# Altium project operacake.PrjPcb
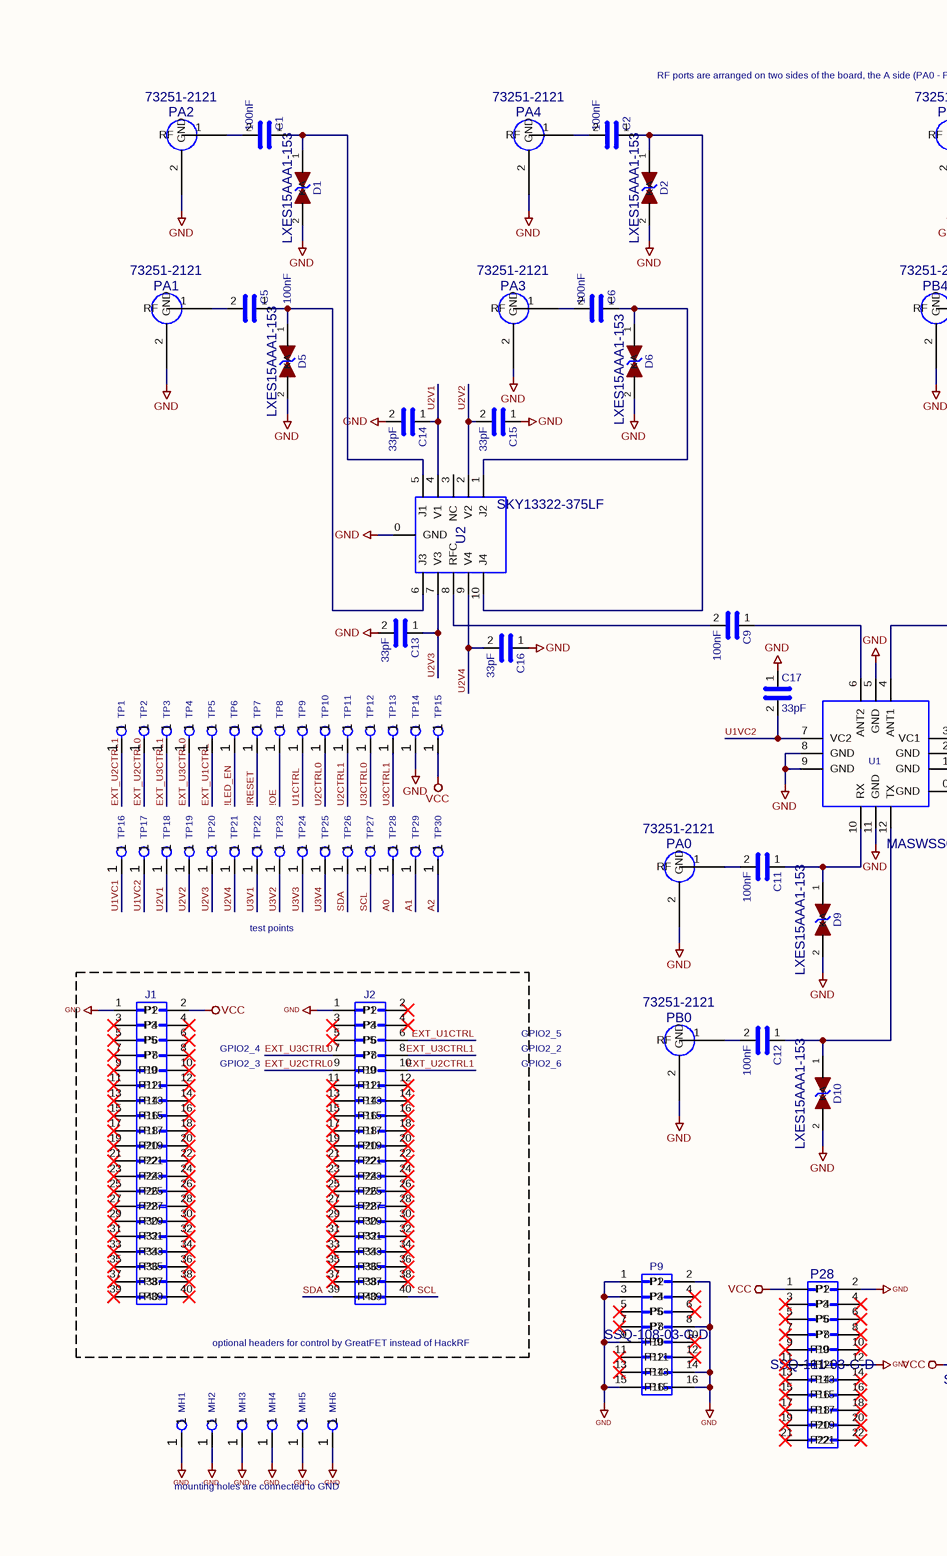
[diagram p0: operacake.SchDoc, left]
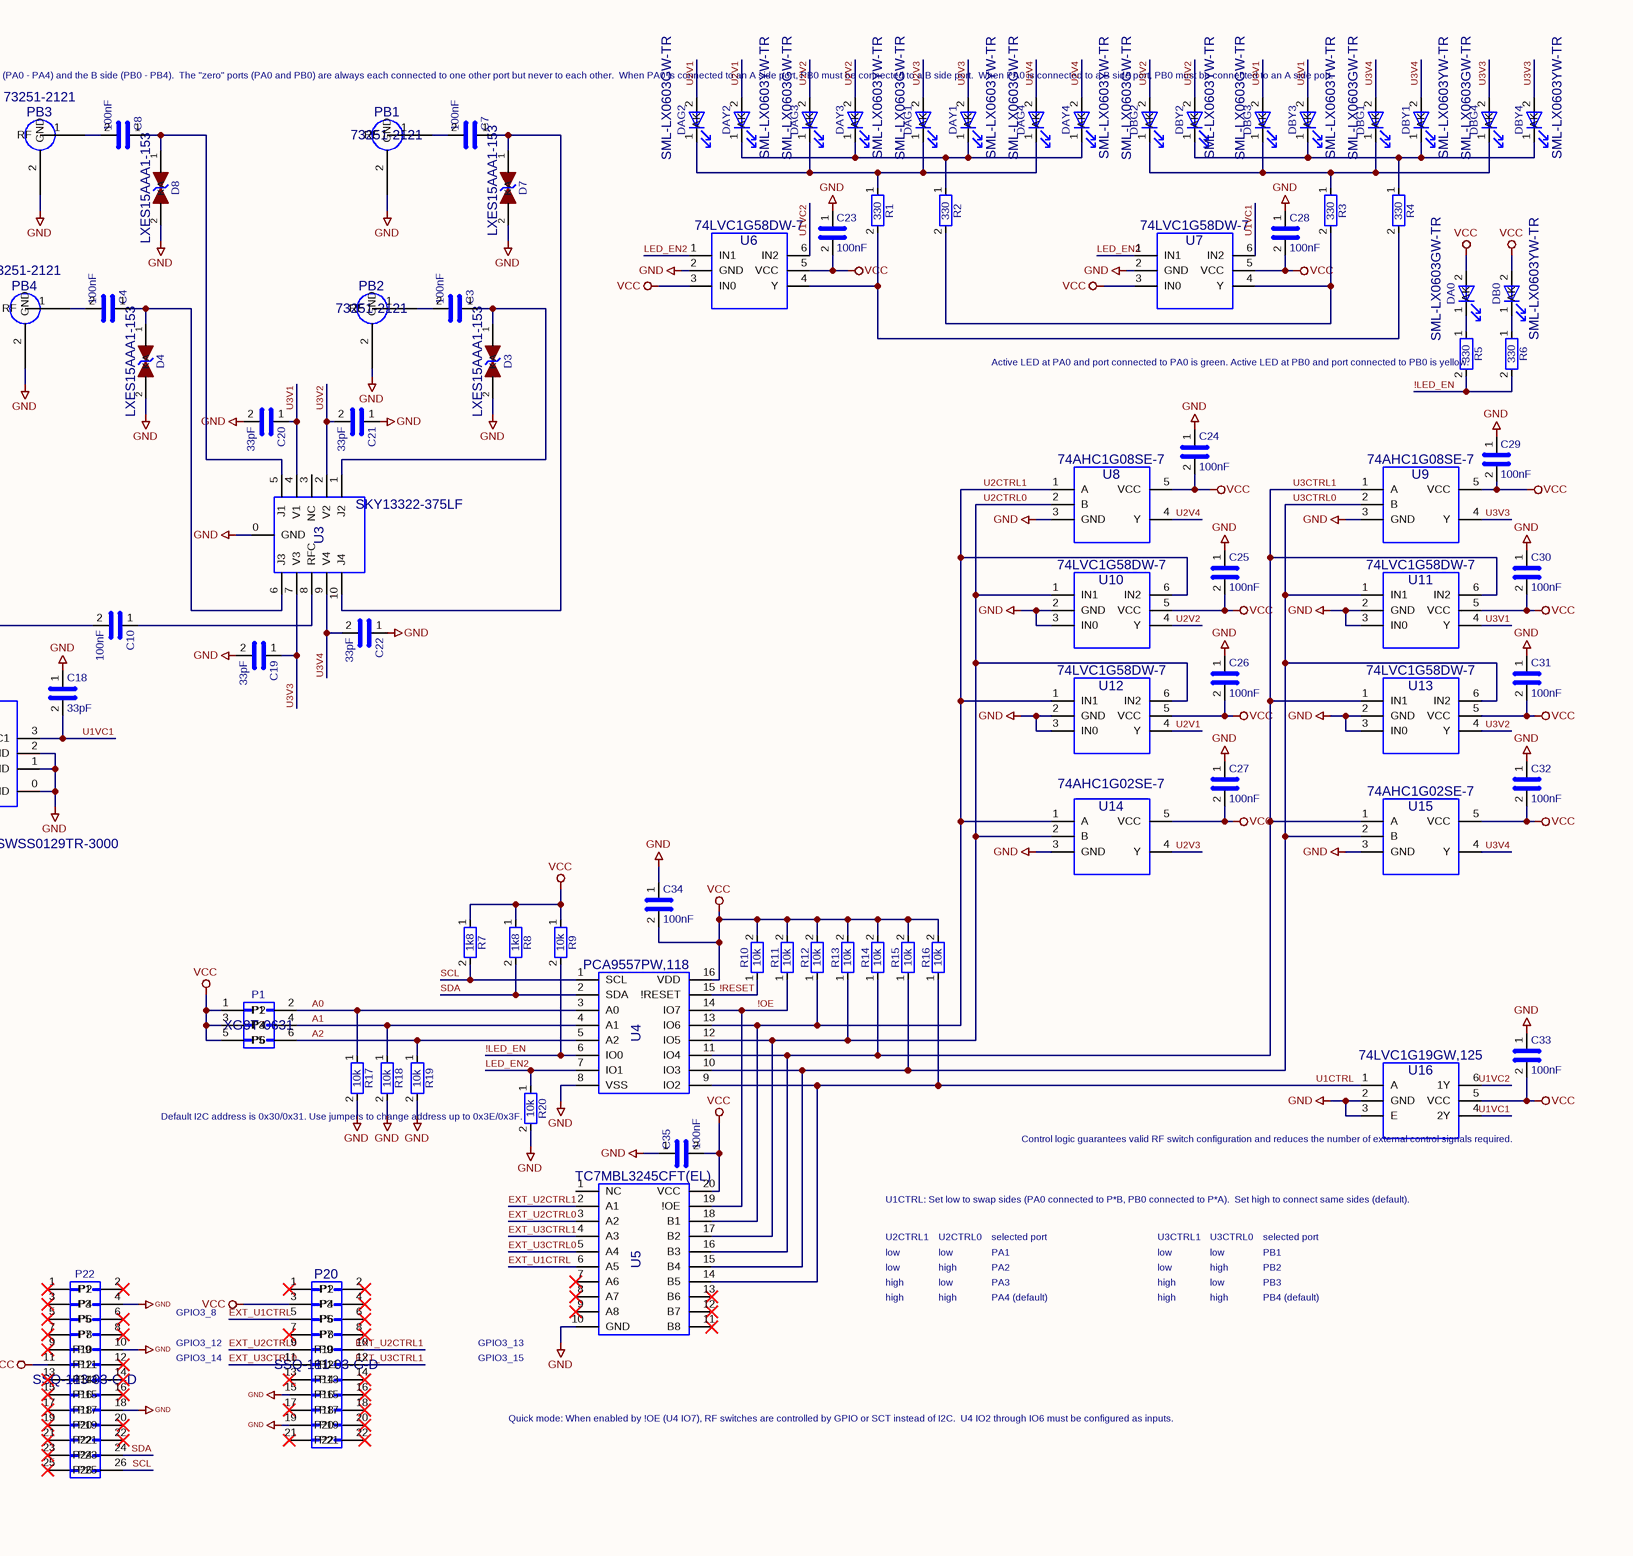
[diagram p1: operacake.SchDoc, right]
1 sheet, 152 parts. Net scope: global (net labels, ports and power ports of the same name join across sheets).
Board file: operacake.PcbDoc

## Sheet operacake.SchDoc
size 431 x 279 mm

### Parts
C1  100nF  [0402]
C2  100nF  [0402]
C3  100nF  [0402]
C4  100nF  [0402]
C5  100nF  [0402]
C6  100nF  [0402]
C7  100nF  [0402]
C8  100nF  [0402]
C9  100nF  [0402]
C10  100nF  [0402]
C11  100nF  [0402]
C12  100nF  [0402]
C13  33pF  [0402]
C14  33pF  [0402]
C15  33pF  [0402]
C16  33pF  [0402]
C17  33pF  [0402]
C18  33pF  [0402]
C19  33pF  [0402]
C20  33pF  [0402]
C21  33pF  [0402]
C22  33pF  [0402]
C23  100nF  [0402]
C24  100nF  [0402]
C25  100nF  [0402]
C26  100nF  [0402]
C27  100nF  [0402]
C28  100nF  [0402]
C29  100nF  [0402]
C30  100nF  [0402]
C31  100nF  [0402]
C32  100nF  [0402]
C33  100nF  [0402]
C34  100nF  [0402]
C35  100nF  [0402]
D1  Part Number: LXES15AAA1-153  [0402]  (hidden comment: GSG-DIODE-TVS-BI)
D2  Part Number: LXES15AAA1-153  [0402]  (hidden comment: GSG-DIODE-TVS-BI)
D3  Part Number: LXES15AAA1-153  [0402]  (hidden comment: GSG-DIODE-TVS-BI)
D4  Part Number: LXES15AAA1-153  [0402]  (hidden comment: GSG-DIODE-TVS-BI)
D5  Part Number: LXES15AAA1-153  [0402]  (hidden comment: GSG-DIODE-TVS-BI)
D6  Part Number: LXES15AAA1-153  [0402]  (hidden comment: GSG-DIODE-TVS-BI)
D7  Part Number: LXES15AAA1-153  [0402]  (hidden comment: GSG-DIODE-TVS-BI)
D8  Part Number: LXES15AAA1-153  [0402]  (hidden comment: GSG-DIODE-TVS-BI)
D9  Part Number: LXES15AAA1-153  [0402]  (hidden comment: GSG-DIODE-TVS-BI)
D10  Part Number: LXES15AAA1-153  [0402]  (hidden comment: GSG-DIODE-TVS-BI)
DA0  Part Number: SML-LX0603GW-TR  [0603D]  (hidden comment: LED)
DAG1  Part Number: SML-LX0603GW-TR  [0603D]  (hidden comment: LED)
DAG2  Part Number: SML-LX0603GW-TR  [0603D]  (hidden comment: LED)
DAG3  Part Number: SML-LX0603GW-TR  [0603D]  (hidden comment: LED)
DAG4  Part Number: SML-LX0603GW-TR  [0603D]  (hidden comment: LED)
DAY1  Part Number: SML-LX0603YW-TR  [0603D]  (hidden comment: LED)
DAY2  Part Number: SML-LX0603YW-TR  [0603D]  (hidden comment: LED)
DAY3  Part Number: SML-LX0603YW-TR  [0603D]  (hidden comment: LED)
DAY4  Part Number: SML-LX0603YW-TR  [0603D]  (hidden comment: LED)
DB0  Part Number: SML-LX0603YW-TR  [0603D]  (hidden comment: LED)
DBG1  Part Number: SML-LX0603GW-TR  [0603D]  (hidden comment: LED)
DBG2  Part Number: SML-LX0603GW-TR  [0603D]  (hidden comment: LED)
DBG3  Part Number: SML-LX0603GW-TR  [0603D]  (hidden comment: LED)
DBG4  Part Number: SML-LX0603GW-TR  [0603D]  (hidden comment: LED)
DBY1  Part Number: SML-LX0603YW-TR  [0603D]  (hidden comment: LED)
DBY2  Part Number: SML-LX0603YW-TR  [0603D]  (hidden comment: LED)
DBY3  Part Number: SML-LX0603YW-TR  [0603D]  (hidden comment: LED)
DBY4  Part Number: SML-LX0603YW-TR  [0603D]  (hidden comment: LED)
J1  CONN_02X20  [HEADER-2x20-REVERSE]  (value not drawn)
J2  CONN_02X20  [HEADER-2x20-REVERSE]  (value not drawn)
MH1  MOUNTING_HOLE  [HOLE126MIL-COPPER]  (value not drawn)
MH2  MOUNTING_HOLE  [HOLE126MIL-COPPER]  (value not drawn)
MH3  MOUNTING_HOLE  [HOLE126MIL-COPPER]  (value not drawn)
MH4  MOUNTING_HOLE  [HOLE126MIL-COPPER]  (value not drawn)
MH5  MOUNTING_HOLE  [HOLE126MIL-COPPER]  (value not drawn)
MH6  MOUNTING_HOLE  [HOLE126MIL-COPPER]  (value not drawn)
P1  Part Number: XG8T-0631  [HEADER-2x3]  (hidden comment: ADDRESS)
P9  Part Number: SSQ-108-03-G-D  [HEADER-2x8]  (hidden comment: BASEBAND)
P20  Part Number: SSQ-111-03-G-D  [HEADER-2x11]  (hidden comment: GPIO)
P22  Part Number: SSQ-113-03-G-D  [HEADER-2x13]  (hidden comment: I2S)
P28  Part Number: SSQ-111-03-G-D  [HEADER-2x11]  (hidden comment: SD)
PA0  Part Number: 73251-2121  [GSG-SMA-73251-2120]  (hidden comment: GSG-RF-CONN)
PA1  Part Number: 73251-2121  [GSG-SMA-73251-2120]  (hidden comment: GSG-RF-CONN)
PA2  Part Number: 73251-2121  [GSG-SMA-73251-2120]  (hidden comment: GSG-RF-CONN)
PA3  Part Number: 73251-2121  [GSG-SMA-73251-2120]  (hidden comment: GSG-RF-CONN)
PA4  Part Number: 73251-2121  [GSG-SMA-73251-2120]  (hidden comment: GSG-RF-CONN)
PB0  Part Number: 73251-2121  [GSG-SMA-73251-2120]  (hidden comment: GSG-RF-CONN)
PB1  Part Number: 73251-2121  [GSG-SMA-73251-2120]  (hidden comment: GSG-RF-CONN)
PB2  Part Number: 73251-2121  [GSG-SMA-73251-2120]  (hidden comment: GSG-RF-CONN)
PB3  Part Number: 73251-2121  [GSG-SMA-73251-2120]  (hidden comment: GSG-RF-CONN)
PB4  Part Number: 73251-2121  [GSG-SMA-73251-2120]  (hidden comment: GSG-RF-CONN)
R1  330  [0603]
R2  330  [0603]
R3  330  [0603]
R4  330  [0603]
R5  330  [0603]
R6  330  [0603]
R7  1k8  [0603]
R8  1k8  [0603]
R9  10k  [0603]
R10  10k  [0603]
R11  10k  [0603]
R12  10k  [0603]
R13  10k  [0603]
R14  10k  [0603]
R15  10k  [0603]
R16  10k  [0603]
R17  10k  [0603]
R18  10k  [0603]
R19  10k  [0603]
R20  10k  [0603]
TP1  CONN_1  [TESTPOINT-50MIL]  (value not drawn)
TP2  CONN_1  [TESTPOINT-50MIL]  (value not drawn)
TP3  CONN_1  [TESTPOINT-50MIL]  (value not drawn)
TP4  CONN_1  [TESTPOINT-50MIL]  (value not drawn)
TP5  CONN_1  [TESTPOINT-50MIL]  (value not drawn)
TP6  CONN_1  [TESTPOINT-50MIL]  (value not drawn)
TP7  CONN_1  [TESTPOINT-50MIL]  (value not drawn)
TP8  CONN_1  [TESTPOINT-50MIL]  (value not drawn)
TP9  CONN_1  [TESTPOINT-50MIL]  (value not drawn)
TP10  CONN_1  [TESTPOINT-50MIL]  (value not drawn)
TP11  CONN_1  [TESTPOINT-50MIL]  (value not drawn)
TP12  CONN_1  [TESTPOINT-50MIL]  (value not drawn)
TP13  CONN_1  [TESTPOINT-50MIL]  (value not drawn)
TP14  CONN_1  [TESTPOINT-50MIL]  (value not drawn)
TP15  CONN_1  [TESTPOINT-50MIL]  (value not drawn)
TP16  CONN_1  [TESTPOINT-50MIL]  (value not drawn)
TP17  CONN_1  [TESTPOINT-50MIL]  (value not drawn)
TP18  CONN_1  [TESTPOINT-50MIL]  (value not drawn)
TP19  CONN_1  [TESTPOINT-50MIL]  (value not drawn)
TP20  CONN_1  [TESTPOINT-50MIL]  (value not drawn)
TP21  CONN_1  [TESTPOINT-50MIL]  (value not drawn)
TP22  CONN_1  [TESTPOINT-50MIL]  (value not drawn)
TP23  CONN_1  [TESTPOINT-50MIL]  (value not drawn)
TP24  CONN_1  [TESTPOINT-50MIL]  (value not drawn)
TP25  CONN_1  [TESTPOINT-50MIL]  (value not drawn)
TP26  CONN_1  [TESTPOINT-50MIL]  (value not drawn)
TP27  CONN_1  [TESTPOINT-50MIL]  (value not drawn)
TP28  CONN_1  [TESTPOINT-50MIL]  (value not drawn)
TP29  CONN_1  [TESTPOINT-50MIL]  (value not drawn)
TP30  CONN_1  [TESTPOINT-50MIL]  (value not drawn)
U1  Part Number: MASWSS0129TR-3000  [QFN12-3]  (hidden comment: MASWSS0129)
U2  SKY13322  [SKY13322-375LF]  (value not drawn)
U3  SKY13322  [SKY13322-375LF]  (value not drawn)
U4  Part Number: PCA9557PW,118  [TSSOP16]  (hidden comment: PCA9557)
U5  Part Number: TC7MBL3245CFT(EL)  [TSSOP20]  (hidden comment: TC7MBL3245CFT)
U6  Part Number: 74LVC1G58DW-7  [SOT363]  (hidden comment: 74LVC1G58)
U7  Part Number: 74LVC1G58DW-7  [SOT363]  (hidden comment: 74LVC1G58)
U8  Part Number: 74AHC1G08SE-7  [SOT353-1]  (hidden comment: 74AHC1G08)
U9  Part Number: 74AHC1G08SE-7  [SOT353-1]  (hidden comment: 74AHC1G08)
U10  Part Number: 74LVC1G58DW-7  [SOT363]  (hidden comment: 74LVC1G58)
U11  Part Number: 74LVC1G58DW-7  [SOT363]  (hidden comment: 74LVC1G58)
U12  Part Number: 74LVC1G58DW-7  [SOT363]  (hidden comment: 74LVC1G58)
U13  Part Number: 74LVC1G58DW-7  [SOT363]  (hidden comment: 74LVC1G58)
U14  Part Number: 74AHC1G02SE-7  [SOT353-1]  (hidden comment: 74AHC1G02)
U15  Part Number: 74AHC1G02SE-7  [SOT353-1]  (hidden comment: 74AHC1G02)
U16  Part Number: 74LVC1G19GW,125  [SOT363]  (hidden comment: 74LVC1G19)

### Nets
GND: C13.2 C14.2 C15.1 C16.1 C17.1 C18.1 C19.2 C20.2 C21.1 C22.1 C23.1 C24.1 C25.1 C26.1 C27.1 C28.1 C29.1 C30.1 C31.1 C32.1 C33.1 C34.1 C35.1 D1.2(K) D2.2(K) D3.2(K) D4.2(K) D5.2(K) D6.2(K) D7.2(K) D8.2(K) D9.2(K) D10.2(K) J1.1(P1) J2.1(P1) MH1.1 MH2.1 MH3.1 MH4.1 MH5.1 MH6.1 P9.1(P1) P9.2(P2) P9.3(P3) P9.8(P8) P9.9(P9) P9.14(P14) P9.15(P15) P9.16(P16) P20.15(P15) P20.19(P19) P22.4(P4) P22.10(P10) P22.18(P18) P28.2(P2) P28.12(P12) PA0.2(GND) PA1.2(GND) PA2.2(GND) PA3.2(GND) PA4.2(GND) PB0.2(GND) PB1.2(GND) PB2.2(GND) PB3.2(GND) PB4.2(GND) R17.2 R18.2 R19.2 R20.2 TP14.1 U1.0(GND) U1.1(GND) U1.2(GND) U1.5(GND) U1.8(GND) U1.9(GND) U1.11(GND) U2.0(GND) U3.0(GND) U4.8(VSS) U5.10(GND) U6.2(GND) U7.2(GND) U8.3(GND) U9.3(GND) U10.2(GND) U10.3(IN0) U11.2(GND) U11.3(IN0) U12.2(GND) U12.3(IN0) U13.2(GND) U13.3(IN0) U14.3(GND) U15.3(GND) U16.2(GND) U16.3(E)
VCC: C23.2 C24.2 C25.2 C26.2 C27.2 C28.2 C29.2 C30.2 C31.2 C32.2 C33.2 C34.2 C35.2 DA0.2(A) DB0.2(A) J1.2(P2) P1.1(P1) P1.3(P3) P1.5(P5) P20.3(P3) P22.11(P11) P28.1(P1) R7.1 R8.1 R9.1 R10.2 R11.2 R12.2 R13.2 R14.2 R15.2 R16.2 TP15.1 U4.16(VDD) U5.20(VCC) U6.3(IN0) U6.5(VCC) U7.3(IN0) U7.5(VCC) U8.5(VCC) U9.5(VCC) U10.5(VCC) U11.5(VCC) U12.5(VCC) U13.5(VCC) U14.5(VCC) U15.5(VCC) U16.5(VCC)
!LED_EN: R5.2 R6.2 R9.2 TP6.1 U4.6(IO0)
!OE: R11.1 TP8.1 U4.14(IO7) U5.19(!OE)
!RESET: R10.1 TP7.1 U4.15(!RESET)
A0: P1.2(P2) R17.1 TP28.1 U4.3(A0)
A1: P1.4(P4) R18.1 TP29.1 U4.4(A1)
A2: P1.6(P6) R19.1 TP30.1 U4.5(A2)
EXT_U1CTRL: J2.6(P6) P20.5(P5) TP5.1 U5.6(A5)
EXT_U2CTRL0: J2.9(P9) P20.9(P9) TP2.1 U5.3(A2)
EXT_U2CTRL1: J2.10(P10) P20.10(P10) TP1.1 U5.2(A1)
EXT_U3CTRL0: J2.7(P7) P20.11(P11) TP4.1 U5.5(A4)
EXT_U3CTRL1: J2.8(P8) P20.12(P12) TP3.1 U5.4(A3)
LED_EN2: R20.1 U4.7(IO1) U6.1(IN1) U7.1(IN1)
SCL: J2.40(P40) P22.26(P26) R7.2 TP27.1 U4.1(SCL)
SDA: J2.39(P39) P22.24(P24) R8.2 TP26.1 U4.2(SDA)
U1CTRL: R16.1 TP9.1 U4.9(IO2) U5.14(B5) U16.1(A)
U1VC1: C18.2 TP16.1 U1.3(VC1) U7.6(IN2) U16.4(2Y)
U1VC2: C17.2 TP17.1 U1.7(VC2) U6.6(IN2) U16.6(1Y)
U2CTRL0: R13.1 TP10.1 U4.12(IO5) U5.17(B2) U8.2(B) U10.1(IN1) U12.6(IN2) U14.2(B)
U2CTRL1: R12.1 TP11.1 U4.13(IO6) U5.18(B1) U8.1(A) U10.6(IN2) U12.1(IN1) U14.1(A)
U2V1: C14.1 DAG2.2(A) DAY2.2(A) TP18.1 U2.4(V1) U12.4(Y)
U2V2: C15.2 DAG3.2(A) DAY3.2(A) TP19.1 U2.2(V2) U10.4(Y)
U2V3: C13.1 DAG1.2(A) DAY1.2(A) TP20.1 U2.7(V3) U14.4(Y)
U2V4: C16.2 DAG4.2(A) DAY4.2(A) TP21.1 U2.9(V4) U8.4(Y)
U3CTRL0: R15.1 TP12.1 U4.10(IO3) U5.15(B4) U9.2(B) U11.1(IN1) U13.6(IN2) U15.2(B)
U3CTRL1: R14.1 TP13.1 U4.11(IO4) U5.16(B3) U9.1(A) U11.6(IN2) U13.1(IN1) U15.1(A)
U3V1: C20.1 DBG3.2(A) DBY3.2(A) TP22.1 U3.4(V1) U11.4(Y)
U3V2: C21.2 DBG2.2(A) DBY2.2(A) TP23.1 U3.2(V2) U13.4(Y)
U3V3: C19.1 DBG4.2(A) DBY4.2(A) TP24.1 U3.7(V3) U9.4(Y)
U3V4: C22.2 DBG1.2(A) DBY1.2(A) TP25.1 U3.9(V4) U15.4(Y)
NetC1_1: C1.1 D1.1(A) U2.5(J1)
NetC1_2: C1.2 PA2.1(RF)
NetC2_1: C2.1 D2.1(A) U2.10(J4)
NetC2_2: C2.2 PA4.1(RF)
NetC3_1: C3.1 D3.1(A) U3.1(J2)
NetC3_2: C3.2 PB2.1(RF)
NetC4_1: C4.1 D4.1(A) U3.6(J3)
NetC4_2: C4.2 PB4.1(RF)
NetC5_1: C5.1 D5.1(A) U2.6(J3)
NetC5_2: C5.2 PA1.1(RF)
NetC6_1: C6.1 D6.1(A) U2.1(J2)
NetC6_2: C6.2 PA3.1(RF)
NetC7_1: C7.1 D7.1(A) U3.10(J4)
NetC7_2: C7.2 PB1.1(RF)
NetC8_1: C8.1 D8.1(A) U3.5(J1)
NetC8_2: C8.2 PB3.1(RF)
NetC9_1: C9.1 U1.6(ANT2)
NetC9_2: C9.2 U2.8(RFC)
NetC10_1: C10.1 U3.8(RFC)
NetC10_2: C10.2 U1.4(ANT1)
NetC11_1: C11.1 D9.1(A) U1.10(RX)
NetC11_2: C11.2 PA0.1(RF)
NetC12_1: C12.1 D10.1(A) U1.12(TX)
NetC12_2: C12.2 PB0.1(RF)
NetDA0_1: DA0.1(K) R5.1
NetDAG1_1: DAG1.1(K) DAG2.1(K) DAG3.1(K) DAG4.1(K) R1.1
NetDAY1_1: DAY1.1(K) DAY2.1(K) DAY3.1(K) DAY4.1(K) R2.1
NetDB0_1: DB0.1(K) R6.1
NetDBG1_1: DBG1.1(K) DBG2.1(K) DBG3.1(K) DBG4.1(K) R3.1
NetDBY1_1: DBY1.1(K) DBY2.1(K) DBY3.1(K) DBY4.1(K) R4.1
NetR1_2: R1.2 R4.2 U6.4(Y)
NetR2_2: R2.2 R3.2 U7.4(Y)

Not connected (* = marked no-connect by the designer): J1 3(P3)* 4(P4)* 5(P5)* 6(P6)* 7(P7)* 8(P8)* 9(P9)* 10(P10)* 11(P11)* 12(P12)* 13(P13)* 14(P14)* 15(P15)* 16(P16)* 17(P17)* 18(P18)* 19(P19)* 20(P20)* 21(P21)* 22(P22)* 23(P23)* 24(P24)* 25(P25)* 26(P26)* 27(P27)* 28(P28)* 29(P29)* 30(P30)* 31(P31)* 32(P32)* 33(P33)* 34(P34)* 35(P35)* 36(P36)* 37(P37)* 38(P38)* 39(P39)* 40(P40)*; J2 2(P2)* 3(P3)* 4(P4)* 5(P5)* 11(P11)* 12(P12)* 13(P13)* 14(P14)* 15(P15)* 16(P16)* 17(P17)* 18(P18)* 19(P19)* 20(P20)* 21(P21)* 22(P22)* 23(P23)* 24(P24)* 25(P25)* 26(P26)* 27(P27)* 28(P28)* 29(P29)* 30(P30)* 31(P31)* 32(P32)* 33(P33)* 34(P34)* 35(P35)* 36(P36)* 37(P37)* 38(P38)*; P9 4(P4)* 5(P5)* 6(P6)* 7(P7)* 10(P10)* 11(P11)* 12(P12)* 13(P13)*; P20 1(P1)* 2(P2)* 4(P4)* 6(P6)* 7(P7)* 8(P8)* 13(P13)* 14(P14)* 16(P16)* 17(P17)* 18(P18)* 20(P20)* 21(P21)* 22(P22)*; P22 1(P1)* 2(P2)* 3(P3)* 5(P5)* 6(P6)* 7(P7)* 8(P8)* 9(P9)* 12(P12)* 13(P13)* 14(P14)* 15(P15)* 16(P16)* 17(P17)* 19(P19)* 20(P20)* 21(P21)* 22(P22)* 23(P23)* 25(P25)*; P28 3(P3)* 4(P4)* 5(P5)* 6(P6)* 7(P7)* 8(P8)* 9(P9)* 10(P10)* 11(P11)* 13(P13)* 14(P14)* 15(P15)* 16(P16)* 17(P17)* 18(P18)* 19(P19)* 20(P20)* 21(P21)* 22(P22)*; U2 3(NC); U3 3(NC); U5 1(NC) 7(A6)* 8(A7)* 9(A8)* 11(B8)* 12(B7)* 13(B6)*

### Notes on the sheet
- RF ports are arranged on two sides of the board, the A side
  (PA0 - PA4) and the B side (PB0 - PB4).  The "zero" ports (PA0
  and PB0) are always each connected to one other port but
  never to each other.  When PA0 is connected to an A side port,
  PB0 must be connected to a B side port.  When PA0 is connected
  to a B side port, PB0 must be connected to an A side port.
- Active LED at PA0 and port connected to PA0 is green.
  Active LED at PB0 and port connected to PB0 is yellow.
- test points
- (near J1) GPIO2_4
- (near J1) GPIO2_3
- GPIO2_6
- GPIO2_5
- GPIO2_2
- (near R20) Default I2C address is 0x30/0x31.
  Use jumpers to change address
  up to 0x3E/0x3F.
- (near U16) Control logic guarantees valid RF switch
  configuration and reduces the number
  of external control signals required.
- U1CTRL: Set low to swap sides (PA0 connected to P*B, PB0
  connected to P*A).  Set high to connect same sides (default).
- U2CTRL1
- U2CTRL0
- selected port
- U3CTRL1
- U3CTRL0
- GPIO3_8
- low
- high
- PA4 (default)
- PA3
- PA2
- PA1
- PB2
- PB3
- PB1
- PB4 (default)
- optional headers for control by
  GreatFET instead of HackRF
- GPIO3_12
- GPIO3_14
- GPIO3_15
- GPIO3_13
- Quick mode: When enabled by !OE (U4 IO7), RF switches are
  controlled by GPIO or SCT instead of I2C.  U4 IO2 through IO6
  must be configured as inputs.
- mounting holes are connected to GND
- 1
- 2
- 3
- 4
- 5
- 6
- 7
- 8
- A
- B
- C
- D
- E
- License: GPL v2
- Title: Opera Cake
- File: operacake.kicad_sch
- Sheet: /
- Copyright 2016 Great Scott Gadgets
- KiCad E.D.A.  kicad (5.1.4)-1
- Size: User
- Date: 2016-10-04
- Rev:
- Id: 1/1

### Library data of the parts
C1-C12 C23-C35 = C: Manufacturer: Murata; Part Number: GRM155R61A104KA01D; Value: 100nF; Footprint: gsg-modules:0402
C13-C22 = C: Manufacturer: Murata; Part Number: GRM1555C1H330JA01D; Value: 33pF; Footprint: gsg-modules:0402
D1-D10 = GSG-DIODE-TVS-BI: Manufacturer: Murata; Value: GSG-DIODE-TVS-BI; Footprint: gsg-modules:0402
DA0 DAG1-DAG4 DAY1-DAY4 DB0 DBG1-DBG4 DBY1-DBY4 = LED: Manufacturer: Lumex; Value: LED; Footprint: gsg-modules:0603D
J1 J2 = CONN_02X20: Note: DNP; Value: CONN_02X20; Footprint: gsg-modules:HEADER-2x20-REVERSE
MH1-MH6 TP1-TP30 = CONN_1: Note: DNP
  MH1-MH6: Value: MOUNTING_HOLE; Footprint: gsg-modules:HOLE126MIL-COPPER
  TP1-TP30: Value: CONN_1; Footprint: gsg-modules:TESTPOINT-50MIL
P1 = CONN_02X03: Manufacturer: Omron; Value: ADDRESS; Footprint: gsg-modules:HEADER-2x3
P9 = CONN_02X08: Manufacturer: Samtec; Note: DNP; Value: BASEBAND; Footprint: gsg-modules:HEADER-2x8
P20 = CONN_02X11: Manufacturer: Samtec; Desciption: CONN RCPT .100" 22POS DUAL GOLD; Value: GPIO; Footprint: gsg-modules:HEADER-2x11
P22 = CONN_02X13: Manufacturer: Samtec; Value: I2S; Footprint: gsg-modules:HEADER-2x13
P28 = CONN_02X11: Manufacturer: Samtec; Value: SD; Footprint: gsg-modules:HEADER-2x11
PA0-PA4 PB0-PB4 = GSG-RF-CONN: Manufacturer: Molex; Value: GSG-RF-CONN; Footprint: hackrf:GSG-SMA-73251-2120
R1-R6 = R: Manufacturer: Stackpole; Part Number: RMCF0603JT330R; Value: 330; Footprint: gsg-modules:0603
R7 R8 = R: Note: DNP; Value: 1k8; Footprint: gsg-modules:0603
R9-R20 = R: Manufacturer: Panasonic; Part Number: ERJ-3GEYJ103V; Value: 10k; Footprint: gsg-modules:0603
U1 = MASWSS0129: Manufacturer: M/A-Com; Value: MASWSS0129; Footprint: gsg-modules:QFN12-3
U2 U3 = SKY13322: Manufacturer: Skyworks; Part Number: SKY13322-375LF; Value: SKY13322; Footprint: gsg-modules:SKY13322-375LF
U4 = PCA9557: Manufacturer: NXP; Value: PCA9557; Footprint: gsg-modules:TSSOP16
U5 = TC7MBL3245CFT: Manufacturer: Toshiba; Value: TC7MBL3245CFT; Footprint: gsg-modules:TSSOP20
U6 U7 U10-U13 = 74LVC1G58: Manufacturer: Diodes Inc.; Value: 74LVC1G58; Footprint: gsg-modules:SOT363
U8 U9 U14 U15 = 74AHC1G08: Manufacturer: Diodes Inc.; Footprint: gsg-modules:SOT353-1
  U8 U9: Value: 74AHC1G08
  U14 U15: Value: 74AHC1G02
U16 = 74LVC1G19: Manufacturer: NXP; Value: 74LVC1G19; Footprint: gsg-modules:SOT363